# Altium schematic sheet AdcPmodDigital.SchDoc
size A4
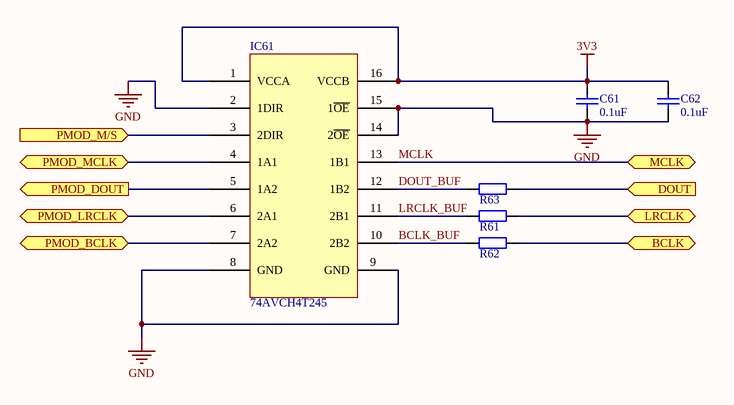
[diagram p0: AdcPmodDigital.SchDoc]

## Parts
C61  0.1uF  [CAP0805]
C62  0.1uF  [CAP0805]
IC61  74AVCH4T245  [TSSOP16]
R61  RES  [RES0805]  (value not drawn)
R62  RES  [RES0805]  (value not drawn)
R63  RES  [RES0805]  (value not drawn)

## Ports
BCLK (bidir), DOUT (in), LRCLK (bidir), MCLK (bidir), PMOD_BCLK, PMOD_DOUT (out), PMOD_LRCLK (bidir), PMOD_M/S (in), PMOD_MCLK (bidir)

## Nets
3V3: C61.2 C62.2 IC61.1(VCCA) IC61.16(VCCB)
GND: C61.1 C62.1 IC61.2(1DIR) IC61.8(GND) IC61.9(GND) IC61.14(2~{OE}) IC61.15(1~{OE})
BCLK: R62.2 ; port BCLK
BCLK_BUF: IC61.10(2B2) R62.1
DOUT: R63.2 ; port DOUT
DOUT_BUF: IC61.12(1B2) R63.1
LRCLK: R61.2 ; port LRCLK
LRCLK_BUF: IC61.11(2B1) R61.1
MCLK: IC61.13(1B1) ; port MCLK
PMOD_BCLK: IC61.7(2A2) ; port PMOD_BCLK
PMOD_DOUT: IC61.5(1A2) ; port PMOD_DOUT
PMOD_LRCLK: IC61.6(2A1) ; port PMOD_LRCLK
PMOD_M/S: IC61.3(2DIR) ; port PMOD_M/S
PMOD_MCLK: IC61.4(1A1) ; port PMOD_MCLK

## Library data of the parts
C61 C62 = CAP: Ceramic X7R; Manufacturer: AVX; Mfr. Part No.: 08055C104KAT2A; Suplier Part No.: 581-08055C104K; Value: 0.1uF; Supplier: Mouser
IC61 = 74AVCH4T245: Translation - Voltage Levels 4-Bit Dual-Supply Bus Xcvr; Manufacturer: Texas Instruments; Mfr. Part No.: SN74AVCH4T245PWR; Suplier Part No.: 595-SN74AVCH4T245PWR; Supplier: Mouser
R61-R63 = RES: Resistor